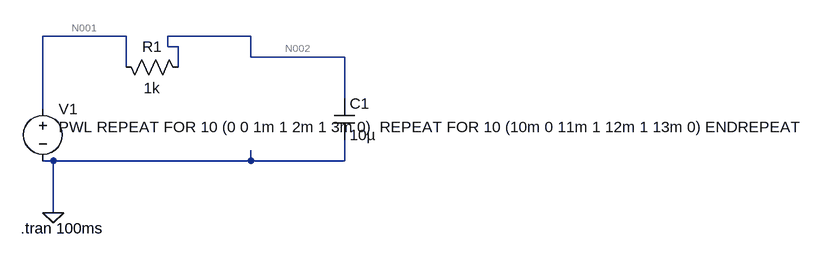
[diagram p0: schematic filtre_passe_bas.asc]
filtre_passe_bas.asc, the LTspice schematic file:
Version 4
SHEET 1 1288 680
WIRE 208 16 80 16
WIRE 400 16 272 16
WIRE 272 32 272 16
WIRE 288 32 272 32
WIRE 400 48 400 16
WIRE 544 48 400 48
WIRE 208 64 208 16
WIRE 288 64 288 32
WIRE 544 112 544 48
WIRE 80 128 80 16
WIRE 96 208 80 208
WIRE 400 208 400 192
WIRE 400 208 96 208
WIRE 544 208 544 176
WIRE 544 208 400 208
WIRE 96 288 96 208
FLAG 96 288 0
SYMBOL voltage 80 112 R0
WINDOW 3 24 44 Left 2
SYMATTR InstName V1
SYMATTR Value PWL REPEAT FOR 10 (0 0 1m 1 2m 1 3m 0)  REPEAT FOR 10 (10m 0 11m 1 12m 1 13m 0) ENDREPEAT
SYMBOL cap 528 112 R0
SYMATTR InstName C1
SYMATTR Value 10µ
SYMBOL res 192 48 M90
WINDOW 0 0 56 VBottom 2
WINDOW 3 32 56 VTop 2
SYMATTR InstName R1
SYMATTR Value 1k
TEXT 46 312 Left 2 !.tran 100ms

The netlist it stands for:
* filtre_passe_bas.asc
V1 N001 0 PWL REPEAT FOR 10 (0 0 1m 1 2m 1 3m 0)  REPEAT FOR 10 (10m 0 11m 1 12m 1 13m 0) ENDREPEAT
C1 N002 0 10µ
R1 N001 N002 1k
.tran 100ms
.backanno
.end

* Results of the author's LTspice run, read from the files saved beside the schematic
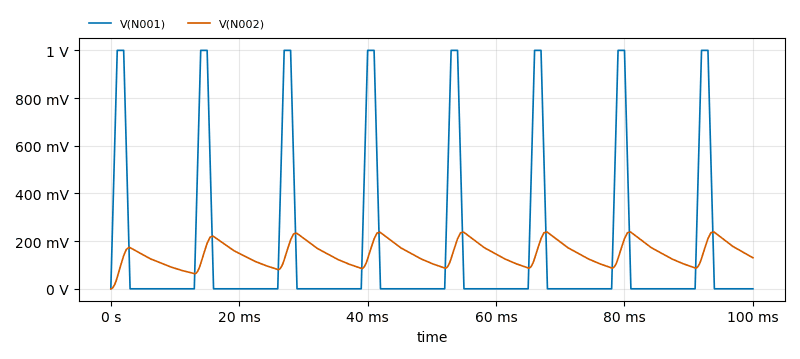
[diagram p1: Transient Analysis of filtre_passe_bas.asc, plotted from the saved traces]
* Transient Analysis, 1 run:
*   V(N001): min 0 V, max 1 V, average 160 mV, rms 368.9 mV, last 0 V
*   V(N002): min 0 V, max 238.4 mV, average 147.6 mV, rms 156.5 mV, last 130.1 mV